# EAGLE design MODUL_GNU-PI_BRIDGE_V100 (EAGLE 6.4)
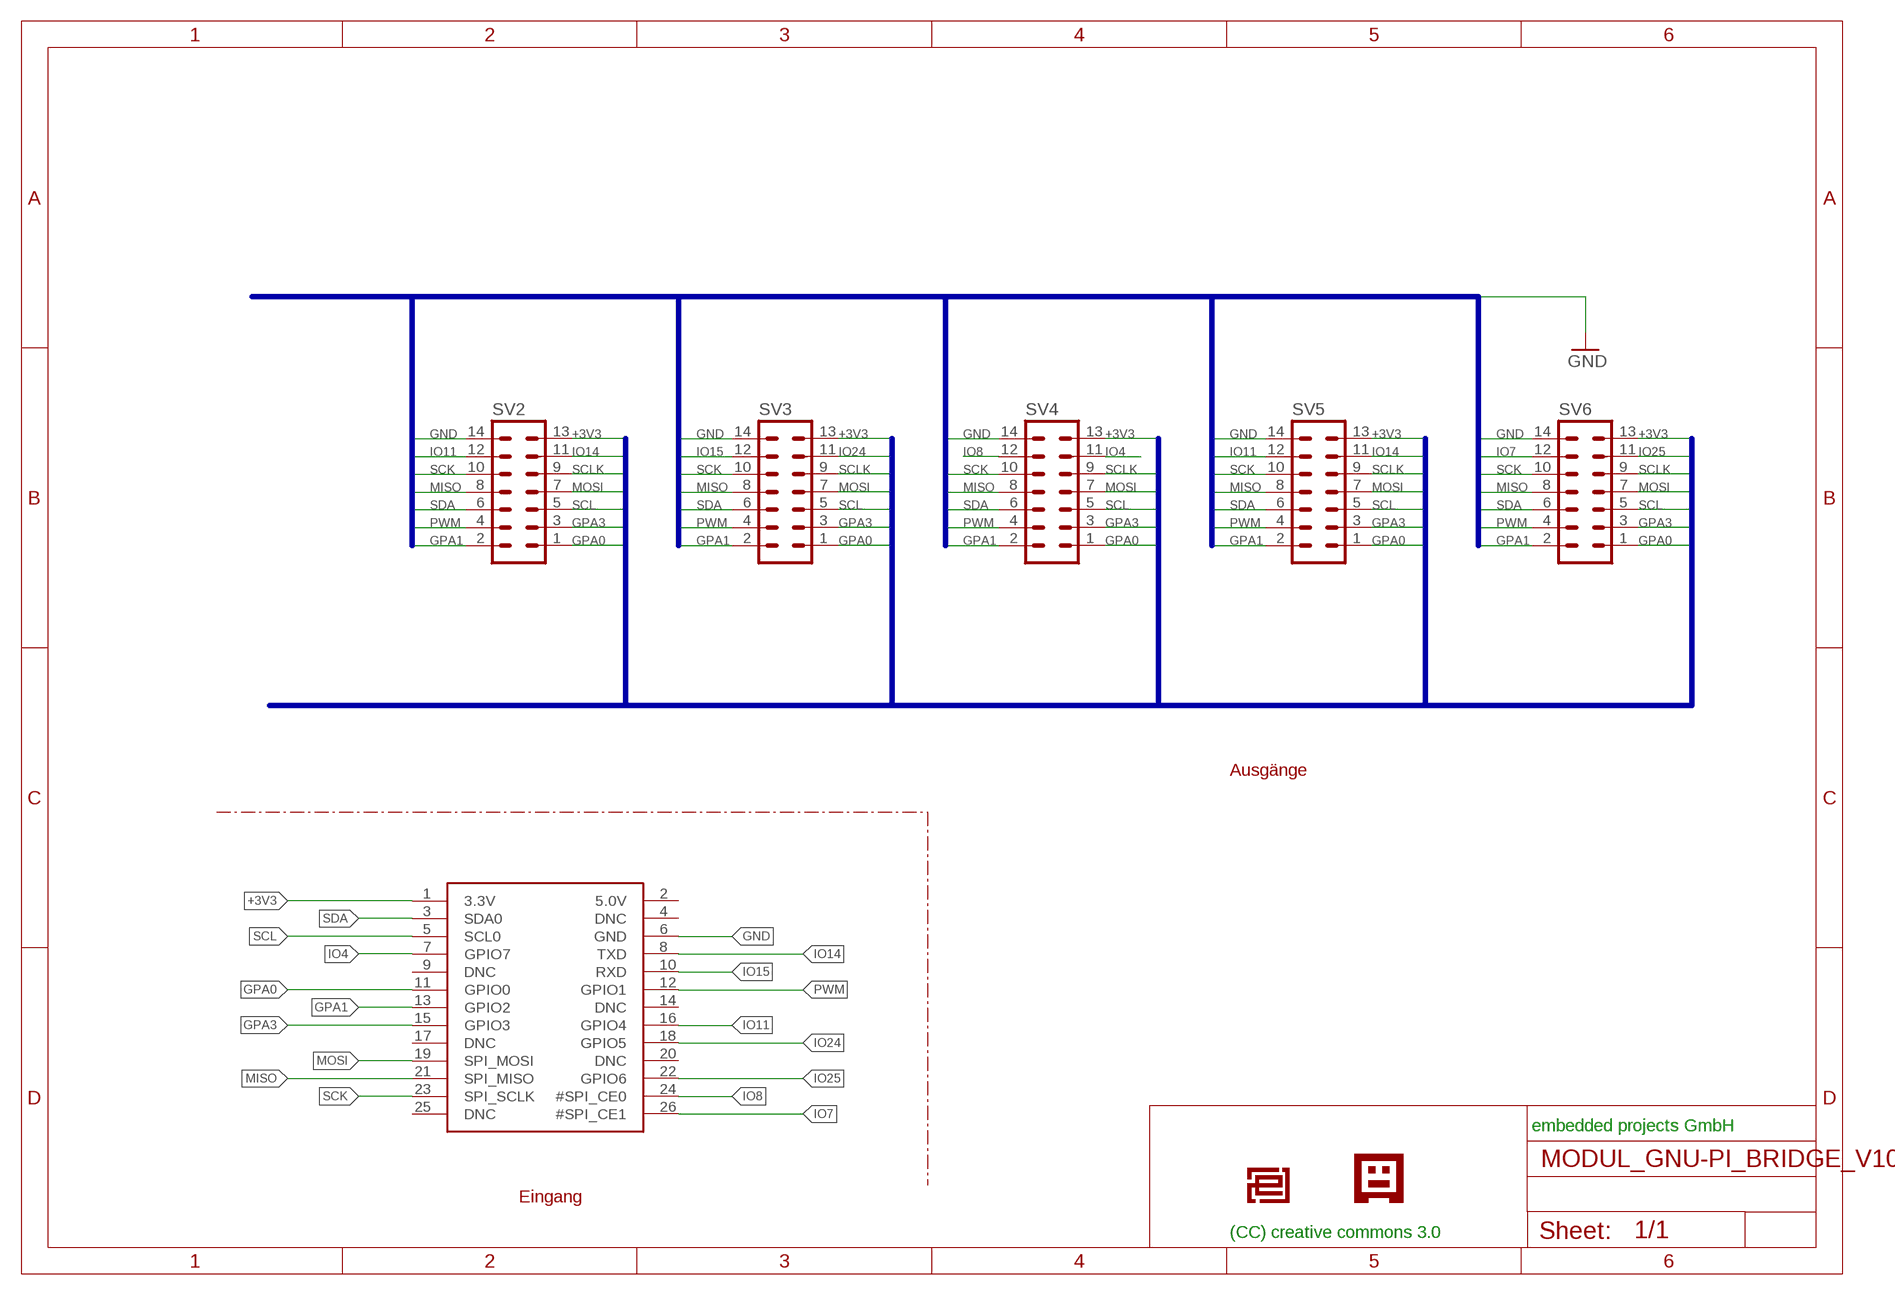
[diagram p0: schematic, sheet 1]

## Parts
SV2  ML14  [ML14]
SV3  ML14  [ML14]
SV4  ML14  [ML14]
SV5  ML14  [ML14]
SV6  ML14  [ML14]
U$1  RASPBERRYPI_BB  [RASBERRYPI_SHIELD]
U$2  EPLOGOSIEB  [EPLOGOSIEBDRUCK]
U$4  GNUBLINLOGOSIEB  [GNUSIEBDRUCK]

## Nets
+3V3: SV2.13 SV3.13 SV4.13 SV5.13 SV6.13 U$1.1(3.3V)
GND: SV2.14 SV3.14 SV4.14 SV5.14 SV6.14 U$1.6(GND)
GPA0: SV2.1 SV3.1 SV4.1 SV5.1 SV6.1 U$1.11(GPIO0)
GPA1: SV2.2 SV3.2 SV4.2 SV5.2 SV6.2 U$1.13(GPIO2)
GPA3: SV2.3 SV3.3 SV4.3 SV5.3 SV6.3 U$1.15(GPIO3)
IO4: SV4.11 U$1.7(GPIO7)
IO7: SV6.12 U$1.26(#SPI_CE1)
IO8: SV4.12 U$1.24(#SPI_CE0)
IO11: SV2.12 SV5.12 U$1.16(GPIO4)
IO14: SV2.11 SV5.11 U$1.8(TXD)
IO15: SV3.12 U$1.10(RXD)
IO24: SV3.11 U$1.18(GPIO5)
IO25: SV6.11 U$1.22(GPIO6)
MISO: SV2.8 SV3.8 SV4.8 SV5.8 SV6.8 U$1.21(SPI_MISO)
MOSI: SV2.7 SV3.7 SV4.7 SV5.7 SV6.7 U$1.19(SPI_MOSI)
PWM: SV2.4 SV3.4 SV4.4 SV5.4 SV6.4 U$1.12(GPIO1)
SCK: SV2.10 SV3.10 SV4.10 SV5.10 SV6.10 U$1.23(SPI_SCLK)
SCL: SV2.5 SV3.5 SV4.5 SV5.5 SV6.5 U$1.5(SCL0)
SCLK: SV2.9 SV3.9 SV4.9 SV5.9 SV6.9
SDA: SV2.6 SV3.6 SV4.6 SV5.6 SV6.6 U$1.3(SDA0)
Unconnected: U$1.2(5.0V) U$1.4(DNC) U$1.9(DNC) U$1.14(DNC) U$1.17(DNC) U$1.20(DNC) U$1.25(DNC)

## Buses
B$1:GPA1,PWM,SDA,MISO,SCK,IO4,IO7,IO11,IO15,GND
B$2:GPA0,GPA3,SCL,MOSI,SCLK,IO8,IO14,IO24,IO25,+3V3

## Notes on the sheet
- Ausgänge
- embedded projects GmbH
- Eingang
- (CC) creative commons 3.0

## Library data of the parts
SV2-SV6 = con-ml:ML14: HARTING
U$1 = microbuilder:RASPBERRYPI_B
U$2 = EmbeddedProjectsLogos2:EPLOGO
U$4 = EmbeddedProjectsLogos2:GNUBLINLOGO

## Board
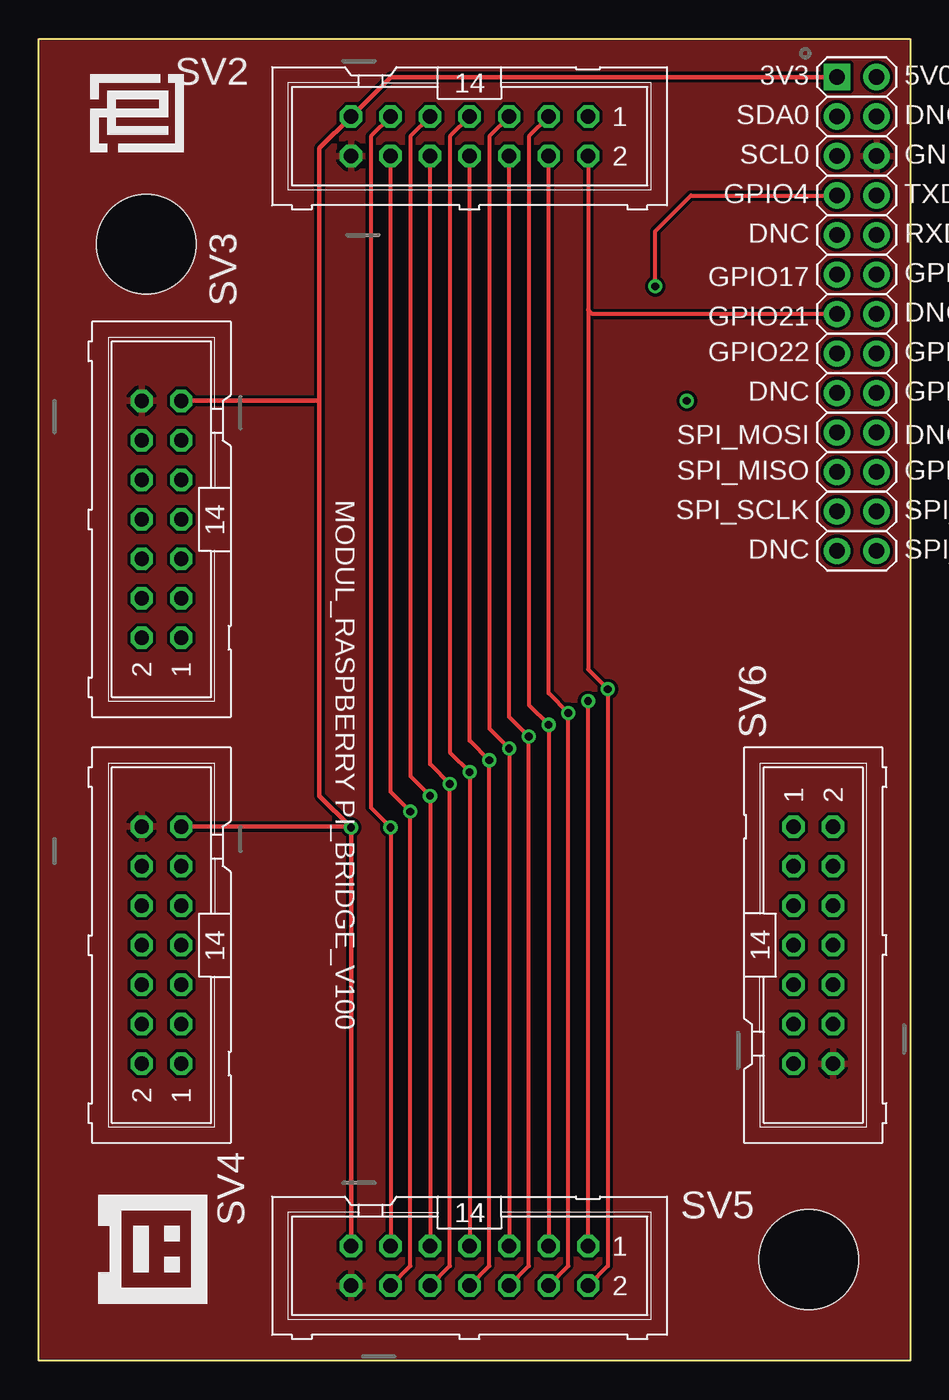
[diagram p1: board, top side]
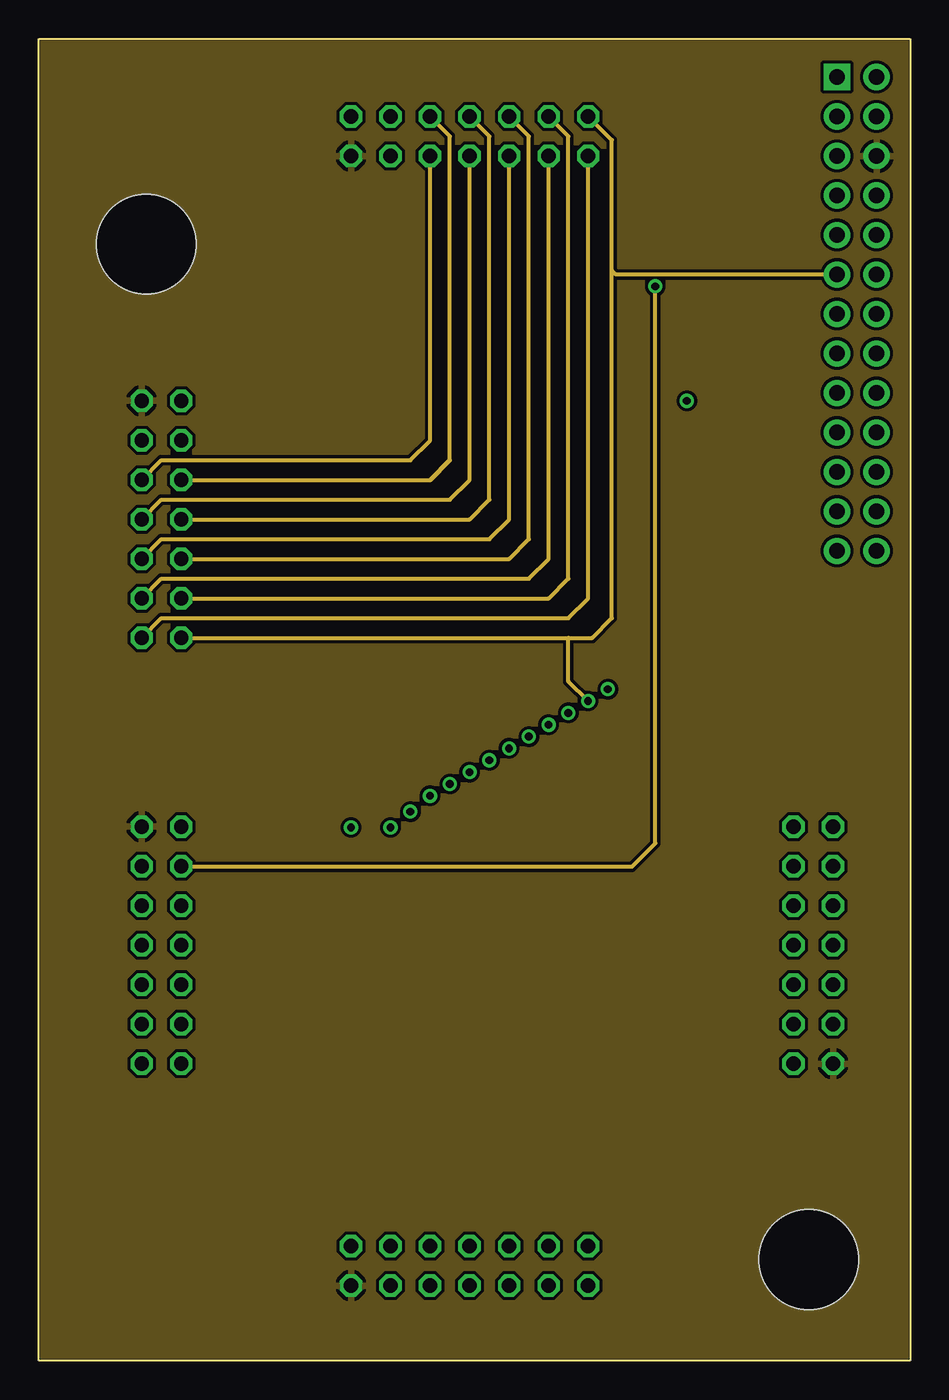
[diagram p2: board, inner layer Route2]
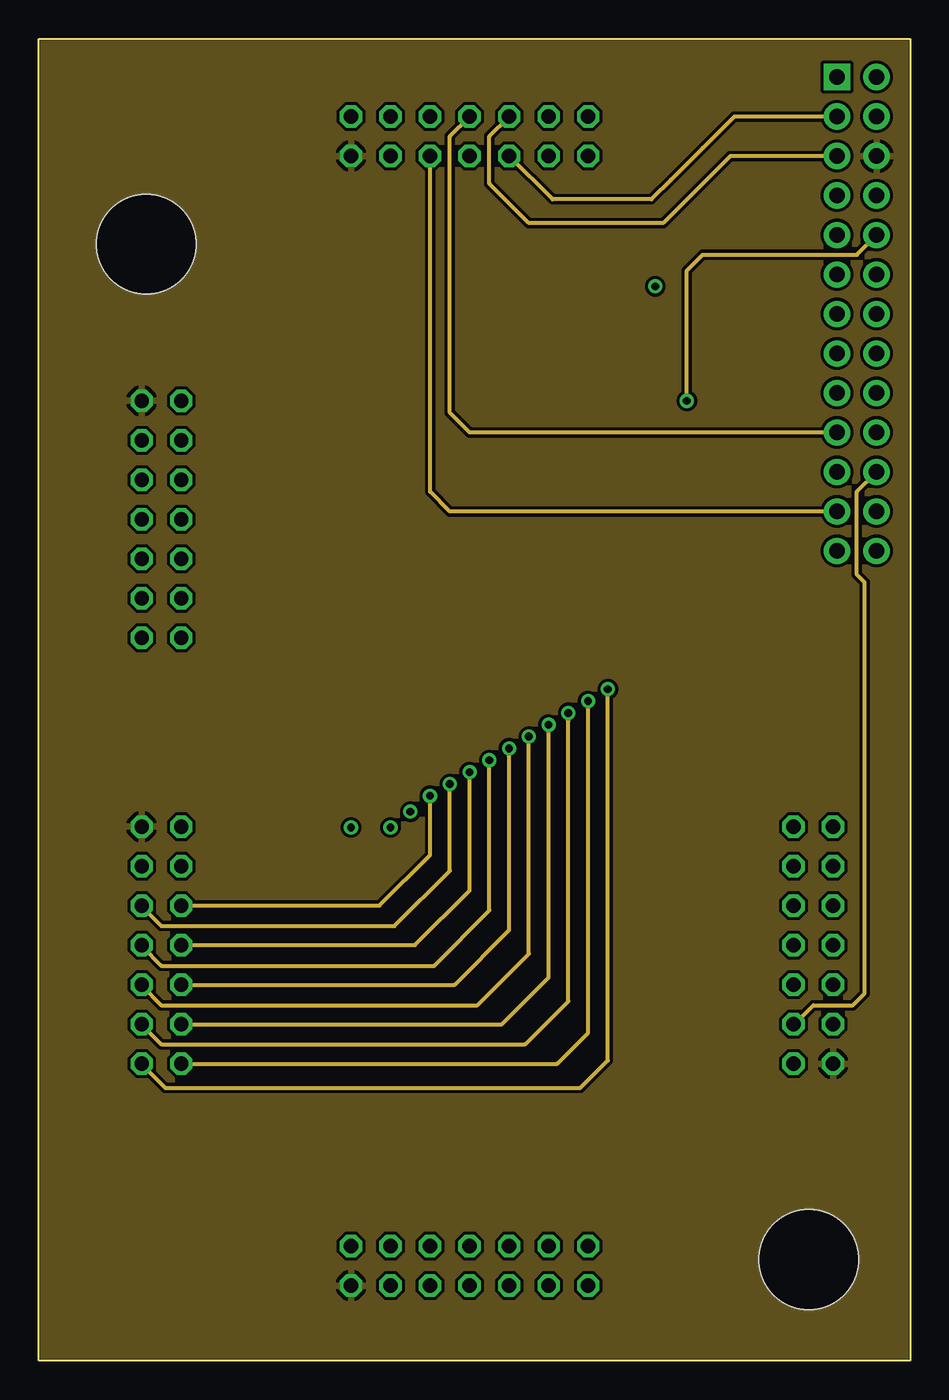
[diagram p3: board, inner layer Route15]
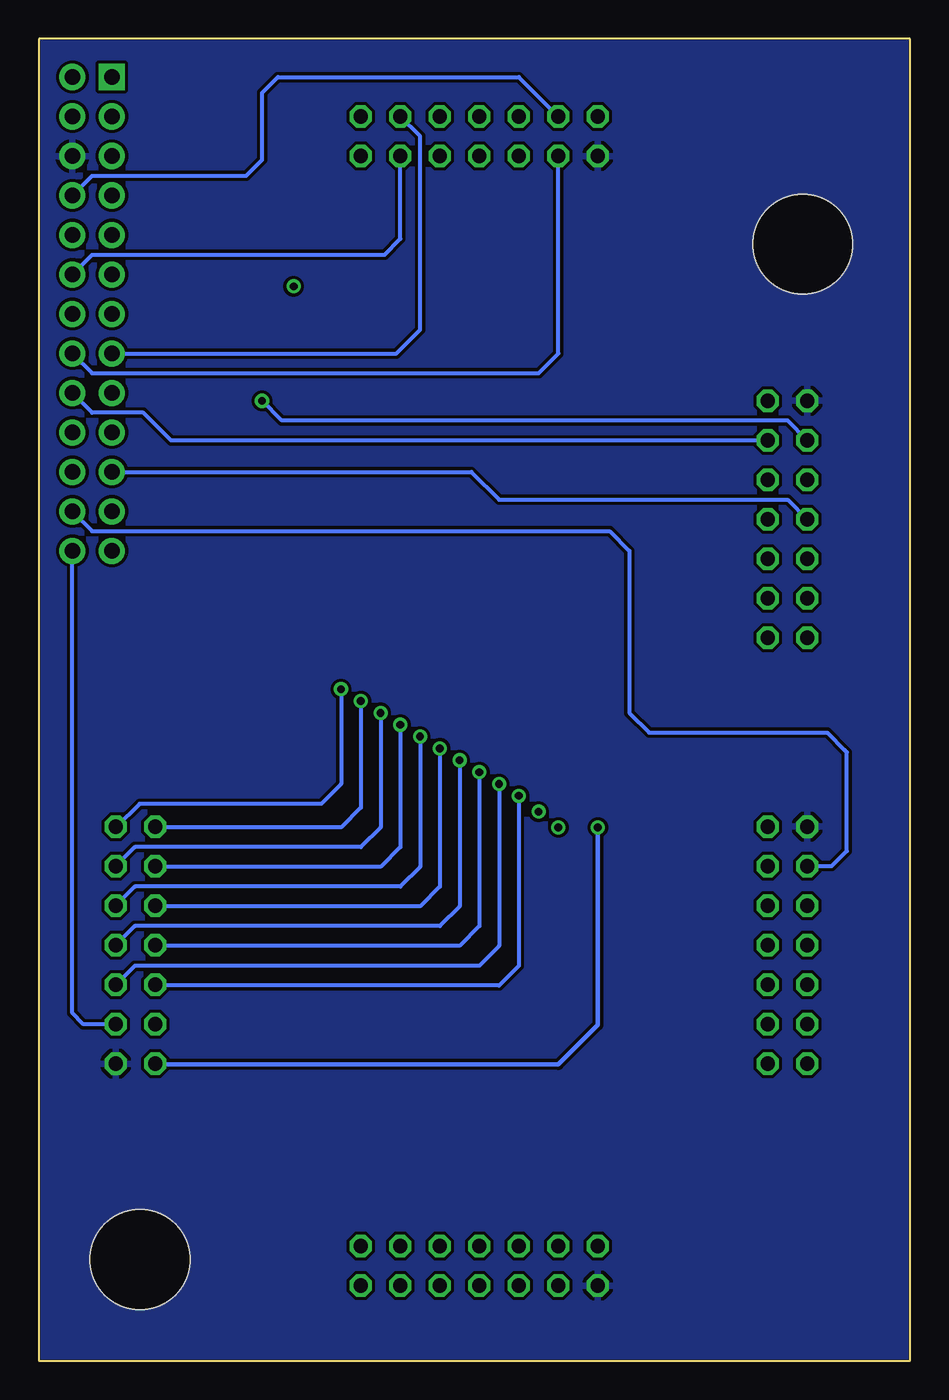
[diagram p4: board, bottom side, seen from below]

Size 56 x 85 mm. Coordinates in mm from the lower left corner, seen from the top.
Copper layers (1*2+15*16): Top 0.035mm / dielectric 1.5mm / Route2 0.035mm / dielectric 0.15mm / Route15 0.035mm / dielectric 0.2mm / Bottom 0.035mm
Design rules "default *": minimum track width 8mil, minimum drill 15mil, track to track 8mil, track to pad 8mil, pad to pad 8mil, via to via 8mil, smd to smd 8mil, copper to edge 1mil, drill to drill 8mil, minimum pad ring 10mil, minimum via ring 8mil, stop-mask expansion 2mil, vias tented up to drill 40mil, thermal gap 10mil
Holes 6.4 mm at 6.9,71.8 49.5,6.5

### Footprints (pad centres in the part's own frame; a part is rotated, then mirrored left to right if it is on the bottom)
ML14 = drill 0.914 octagon: 1 -7.62,-1.27; 2 -7.62,1.27; 3 -5.08,-1.27; 4 -5.08,1.27; 5 -2.54,-1.27; 6 -2.54,1.27; 7 0,-1.27; 8 0,1.27; 9 2.54,-1.27; 10 2.54,1.27; 11 5.08,-1.27; 12 5.08,1.27; 13 7.62,-1.27; 14 7.62,1.27
RASBERRYPI_SHIELD = drill 1 pad 1.676 square: 1 51.308,82.55 | drill 1 pad 1.676: 2 53.848,82.55; 3 51.308,80.01; 4 53.848,80.01; 5 51.308,77.47; 6 53.848,77.47; 7 51.308,74.93; 8 53.848,74.93; 9 51.308,72.39; 10 53.848,72.39; 11 51.308,69.85; 12 53.848,69.85; 13 51.308,67.31; 14 53.848,67.31; 15 51.308,64.77; 16 53.848,64.77; 17 51.308,62.23; 18 53.848,62.23; 19 51.308,59.69; 20 53.848,59.69; 21 51.308,57.15; 22 53.848,57.15; 23 51.308,54.61; 24 53.848,54.61; 25 51.308,52.07; 26 53.848,52.07

### Placement (x,y rotation side)
SV2  27.69,78.74 180 top
SV3  7.87,54.1 90 top
SV4  7.87,26.72 90 top
SV5  27.69,6.1 180 top
SV6  49.78,26.72 270 top
U$1  0,0 0 top
U$2  3.3,77.72 0 top
U$4  3.81,10.67 270 top

### Tracks (layer width: path | path; a pad name or v marks a point on that pad's centre or on a via)
+3V3  (via drill 0.5)
  Top 0.305: 18.03,61.72 18.03,77.98 SV2.13 22.61,82.55 U$1.1 | 18.03,61.72 18.03,36.32 20.02,34.34 | 20.02,34.34 v20.07,34.29 | v20.07,34.29 SV5.13 | SV4.13 20.02,34.34 | 20.02,34.34 v20.07,34.29 | 20.02,34.34 v20.07,34.29 | SV3.13 18.03,61.72
  Bottom 0.305: v20.07,34.29 20.07,21.59 22.61,19.05 48.47,19.05 SV6.13
GND
  pour Route15: -1.02,85.85 57.15,85.85 57.15,-1.52 -1.02,-1.52
  pour Top: -0.76,85.6 56.39,85.6 56.9,-1.02 -1.27,-1.02
  pour Bottom: -0.76,85.6 57.15,85.6 57.15,-1.52 -0.76,-1.52
  pour Route2: -0.51,85.6 56.9,85.6 56.9,-1.02 -0.51,-1.02
GPA0  (via drill 0.5)
  Top 0.254: SV5.1 v35.31,42.42
  Route2 0.254: SV3.1 34.04,46.48 | 34.04,46.48 35.56,46.48 36.83,47.75 36.83,70.1 | 36.83,70.1 36.83,78.49 SV2.1 | v35.31,42.42 34.04,43.69 34.04,46.48 | U$1.11 37.08,69.85 36.83,70.1
  Route15 0.254: SV4.1 33.32,19.1 35.31,21.08 v35.31,42.42
  Bottom 0.254: v35.31,42.42 35.31,35.56 36.58,34.29 48.47,34.29 SV6.1
GPA1  (via drill 0.5)
  Top 0.254: SV2.2 35.31,67.56 | 35.31,67.56 35.31,44.45 v36.58,43.18 36.58,6.1 SV5.2 | U$1.13 35.56,67.31 35.31,67.56
  Route2 0.254: SV3.2 7.87,47.75 34.04,47.75 35.31,49.02 SV2.2
  Route15 0.254: SV4.2 6.6,19.05 8.13,17.53 34.8,17.53 36.58,19.3 v36.58,43.18
  Bottom 0.254: SV6.2 51.01,34.34 49.53,35.81 37.85,35.81 36.58,37.08 v36.58,43.18
GPA3  (via drill 0.5)
  Top 0.254: SV2.3 31.5,78.74 31.5,42.16 v32.77,40.89 SV5.3
  Route2 0.254: SV3.3 32.77,49.02 34.04,50.29 34.04,78.74 SV2.3
  Route15 0.254: SV4.3 29.77,21.64 32.77,24.64 v32.77,40.89
  Bottom 0.254: v32.77,40.89 32.77,33.02 34.04,31.75 48.47,31.75 SV6.3 | U$1.15 33.02,64.77 31.5,66.29 31.5,78.74 SV2.3
IO4  (via drill 0.5)
  Top 0.254: v39.62,69.09 39.62,72.64 41.91,74.93 U$1.7
  Route2 0.254: v39.62,69.09 39.62,33.27 38.1,31.75 9.14,31.75 SV4.11
IO7
  Bottom 0.254: SV6.12 53.13,21.64 53.85,22.35 U$1.26
IO8
  Bottom 0.254: U$1.24 52.58,53.34 19.3,53.34 18.03,52.07 18.03,41.66 16.76,40.39 5.33,40.39 4.19,39.24 | 4.19,39.24 4.06,39.12 | SV4.12 5.03,31.8 4.06,32.77 4.06,39.12 | 4.06,39.12 4.19,39.24
IO11  (via drill 0.5)
  Top 0.254: SV5.12 23.88,6.1 v23.88,35.31 22.61,36.58 SV2.12
  Bottom 0.254: U$1.16 52.58,63.5 23.88,63.5 22.61,64.77 SV2.12
IO14  (via drill 0.5)
  Top 0.254: SV2.11 21.34,78.74 21.34,35.56 v22.61,34.29 SV5.11
  Bottom 0.254: U$1.8 52.58,76.2 42.67,76.2 41.66,77.22 41.66,81.53 40.64,82.55 25.15,82.55 SV2.11
IO15  (via drill 0.5)
  Route15 0.254: v41.66,61.72 41.66,70.1 42.67,71.12 52.58,71.12 U$1.10
  Bottom 0.254: SV3.12 7.87,60.45 40.39,60.45 v41.66,61.72
IO24
  Bottom 0.254: SV3.11 47.5,59.18 49.28,60.96 52.58,60.96 U$1.18
IO25
  Route15 0.254: SV6.11 48.56,21.64 49.78,22.86 52.32,22.86 53.09,23.62 53.09,50.04 52.58,50.55 52.58,55.88 U$1.22
MISO  (via drill 0.5)
  Top 0.254: SV5.8 28.96,6.1 v28.96,38.61 27.69,39.88 SV2.8
  Route2 0.254: SV3.8 7.87,55.37 26.42,55.37 27.69,56.64 SV2.8
  Route15 0.254: SV4.8 6.6,26.67 7.87,25.4 25.4,25.4 28.96,28.96 v28.96,38.61
  Bottom 0.254: v28.96,38.61 28.96,29.21 30.23,27.94 49.83,27.94 SV6.8 | U$1.21 28.19,57.15 26.42,55.37 7.87,55.37 SV3.8
MOSI  (via drill 0.5)
  Top 0.254: SV2.7 26.42,78.74 26.42,39.12 v27.69,37.85 SV5.7
  Route2 0.254: SV3.7 27.69,54.1 28.96,55.37 28.96,78.74 SV2.7
  Route15 0.254: SV4.7 24.18,26.72 27.69,30.23 v27.69,37.85 | U$1.19 27.69,59.69 26.42,60.96 26.42,78.74 SV2.7
  Bottom 0.254: v27.69,37.85 27.69,27.94 28.96,26.67 48.47,26.67 SV6.7
PWM  (via drill 0.5)
  Top 0.254: SV5.4 34.04,6.1 v34.04,41.66 32.77,42.93 SV2.4
  Route2 0.254: SV3.4 7.87,50.29 31.5,50.29 32.77,51.56 SV2.4
  Route15 0.254: SV4.4 6.6,21.59 7.87,20.35 31.25,20.35 34.04,23.11 34.04,41.15 v34.04,41.66
  Bottom 0.254: v34.04,41.66 34.04,34.29 35.31,33.02 49.83,33.02 SV6.4 | U$1.12 52.58,71.12 33.78,71.12 32.77,72.14 SV2.4
SCK  (via drill 0.5)
  Top 0.254: SV5.10 26.42,6.1 v26.42,37.08 25.15,38.35 SV2.10
  Route2 0.254: SV3.10 7.87,57.91 23.88,57.91 25.15,59.18 SV2.10
  Route15 0.254: SV4.10 6.6,29.21 7.87,27.94 22.86,27.94 26.42,31.5 v26.42,37.08 | U$1.23 26.42,54.61 25.15,55.88 SV2.10
  Bottom 0.254: v26.42,37.08 26.42,26.67 27.69,25.4 49.83,25.4 SV6.10
SCL  (via drill 0.5)
  Top 0.254: SV2.5 28.96,78.74 28.96,40.64 v30.23,39.37 SV5.5
  Route2 0.254: SV3.5 30.23,51.56 31.5,52.83 31.5,78.74 SV2.5
  Route15 0.254: SV4.5 26.72,24.18 30.23,27.69 v30.23,39.37 | U$1.5 44.45,77.47 40.13,73.15 31.5,73.15 28.96,75.69 28.96,78.74 SV2.5
  Bottom 0.254: v30.23,39.37 30.23,30.48 31.5,29.21 48.47,29.21 SV6.5
SCLK  (via drill 0.5)
  Top 0.254: SV2.9 23.88,78.74 23.88,37.59 v25.15,36.32 SV5.9
  Route2 0.254: SV3.9 25.15,56.64 | 26.42,57.91 26.42,78.74 SV2.9
  Route2 0.305: 25.15,56.64 26.42,57.91
  Route15 0.254: SV4.9 21.89,29.26 25.15,32.51 v25.15,36.32
  Bottom 0.254: v25.15,36.32 25.15,25.4 26.42,24.13 48.47,24.13 SV6.9
SDA  (via drill 0.5)
  Top 0.254: SV5.6 31.5,6.1 v31.5,40.13 30.23,41.4 SV2.6
  Route2 0.254: SV3.6 7.87,52.83 28.96,52.83 30.23,54.1 SV2.6
  Route15 0.254: SV4.6 6.6,24.13 7.87,22.86 28.19,22.86 31.5,26.16 v31.5,40.13 | U$1.3 44.7,80.01 42.67,77.98 40.64,75.95 39.37,74.68 33.02,74.68 SV2.6
  Bottom 0.254: v31.5,40.13 31.5,31.75 32.77,30.48 49.83,30.48 SV6.6

### Text on the board
tNames: MODUL_RASPBERRY PI_BRIDGE_V100
tDocu: +3V3, IO14, SCLK, MOSI, SCL, GPA3, GPA0 | GND, IO11, SCK, MISO, SDA, PWM, GPA1 | www.gnublin.org | Module-GnuPi | +3V3, IO24, SCLK, MOSI, SCL, GPA3, GPA0 | GND, IO15, SCK, MISO, SDA, PWM, GPA1 | +3V3, IO4, SCLK, MOSI, SCL, GPA3, GPA0 | /dev/spidev-0.0 | GND, IO8, SCK, MISO, SDA, PWM, GPA1 | GND, IO7, SCK, MISO, SDA, PWM, GPA1 | /dev/spidev-0.1 | +3V3, IO25, SCLK, MOSI, SCL, GPA3, GPA0 | +3V3, IO14, SCLK, MOSI, SCL, GPA3, GPA0 | GND, IO11, SCK, MISO, SDA, PWM, GPA1